# EAGLE schematic Matrix_Game_Board (EAGLE 6.5.0)
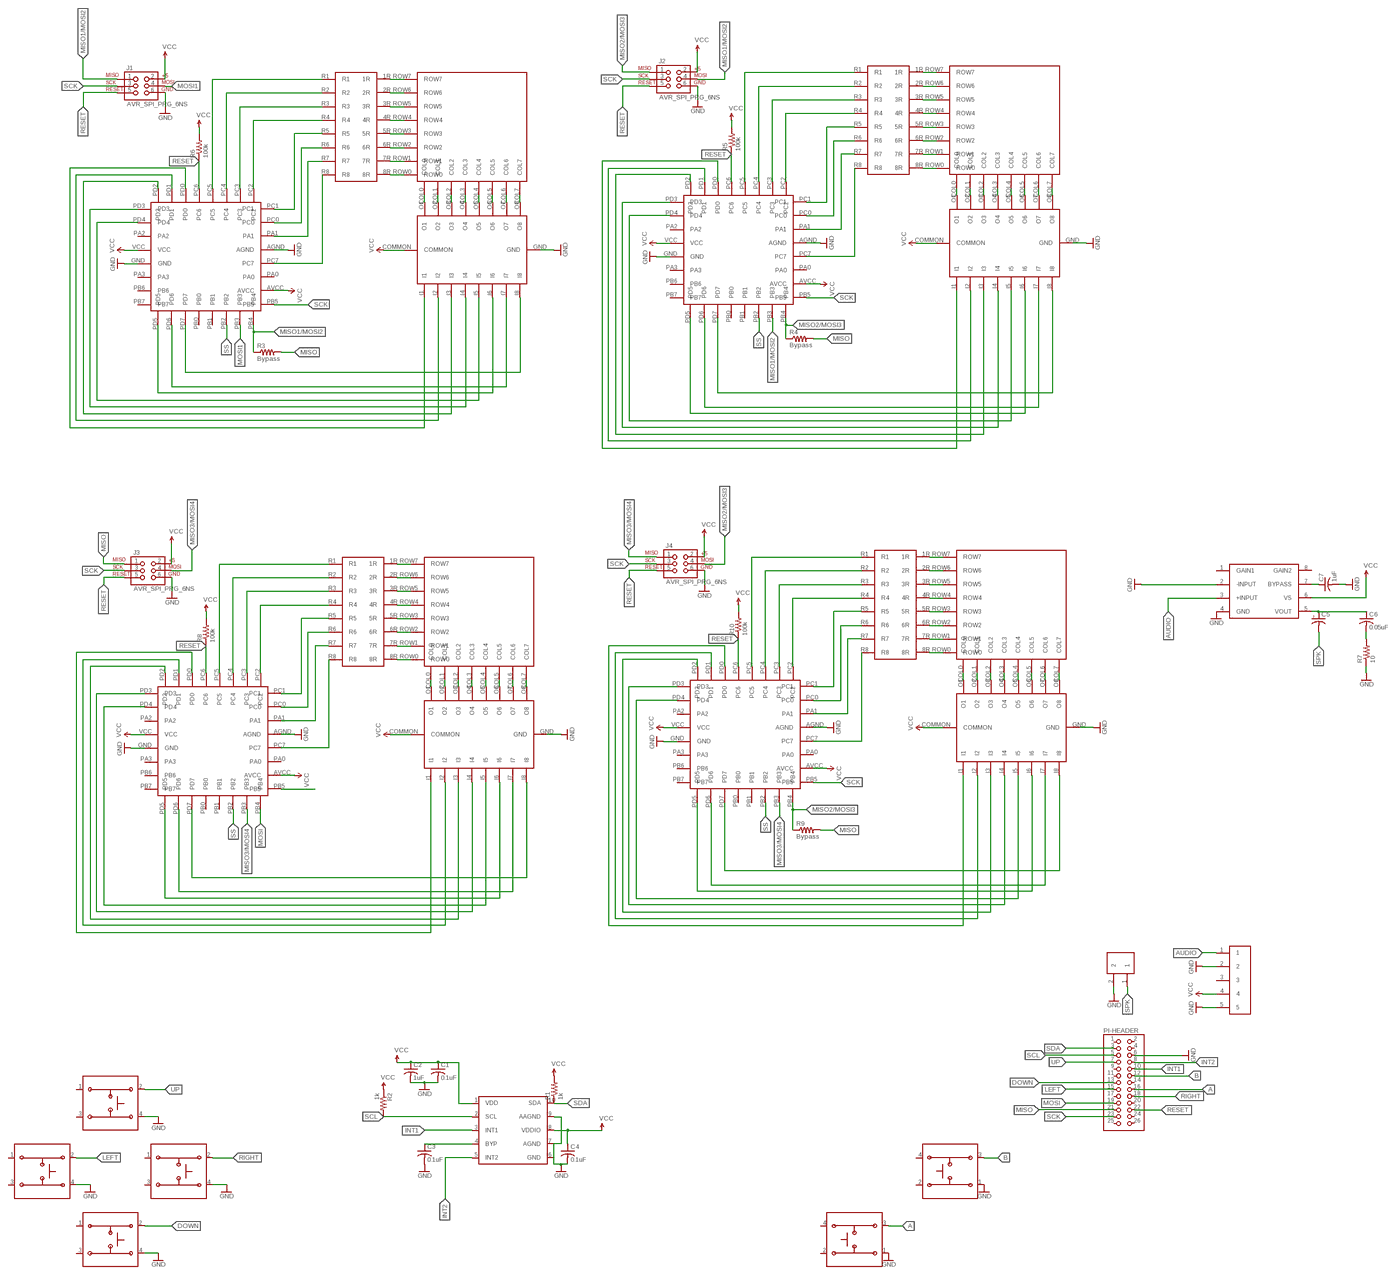
[diagram p0: schematic, sheet 1, overview]
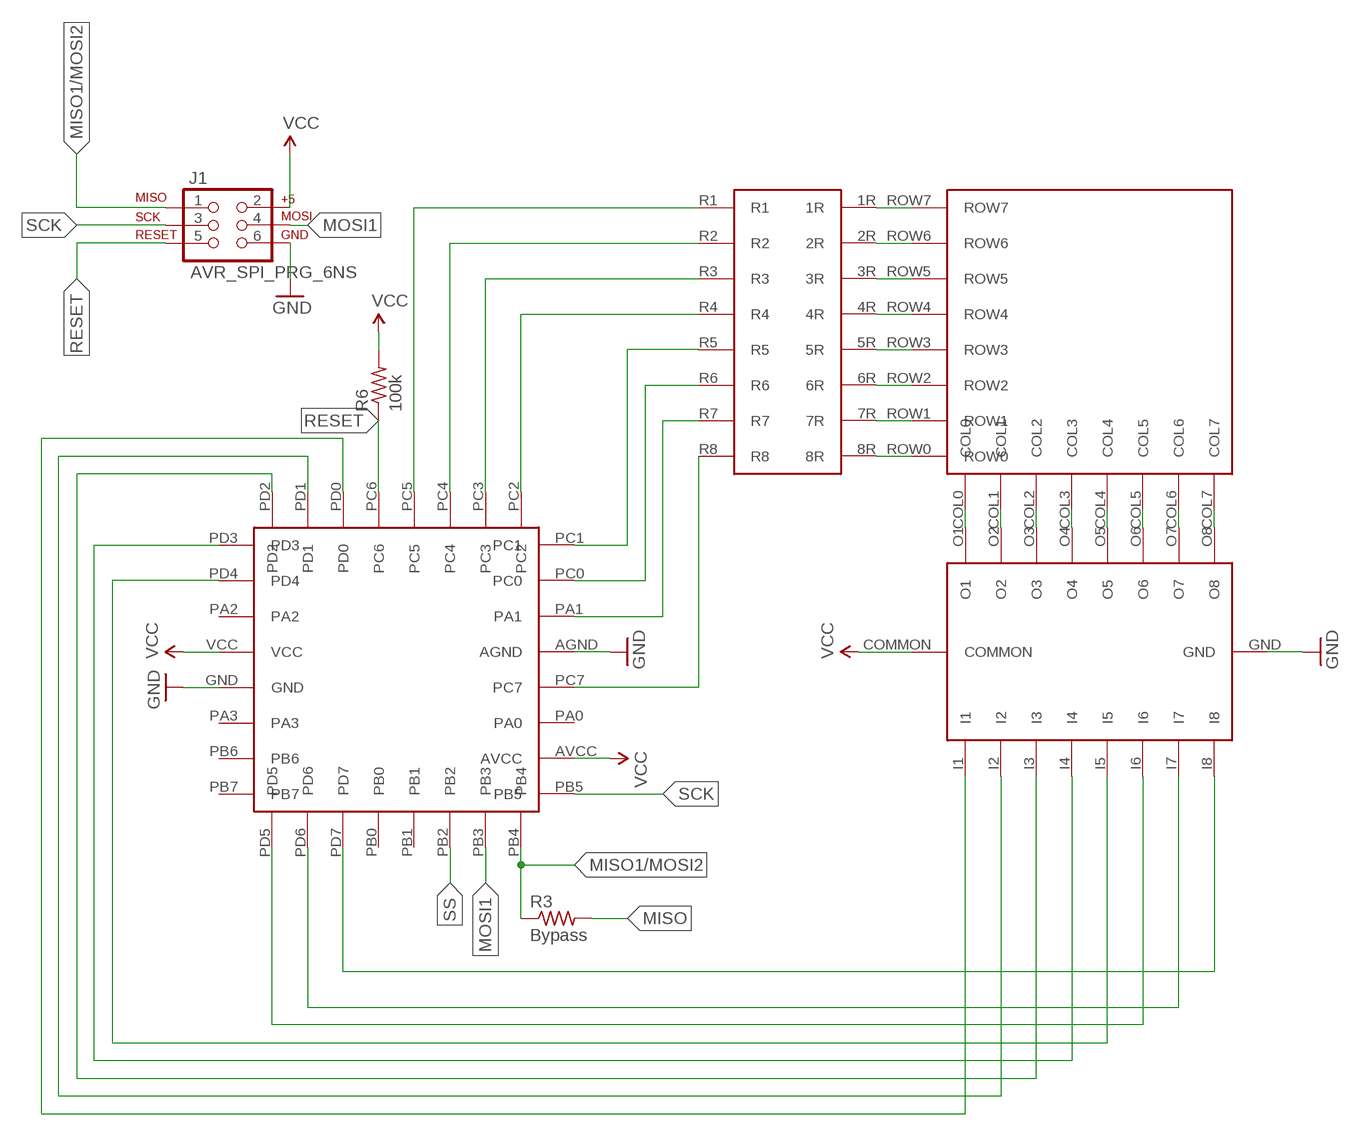
[diagram p1: schematic, sheet 1, part 1 of 4]
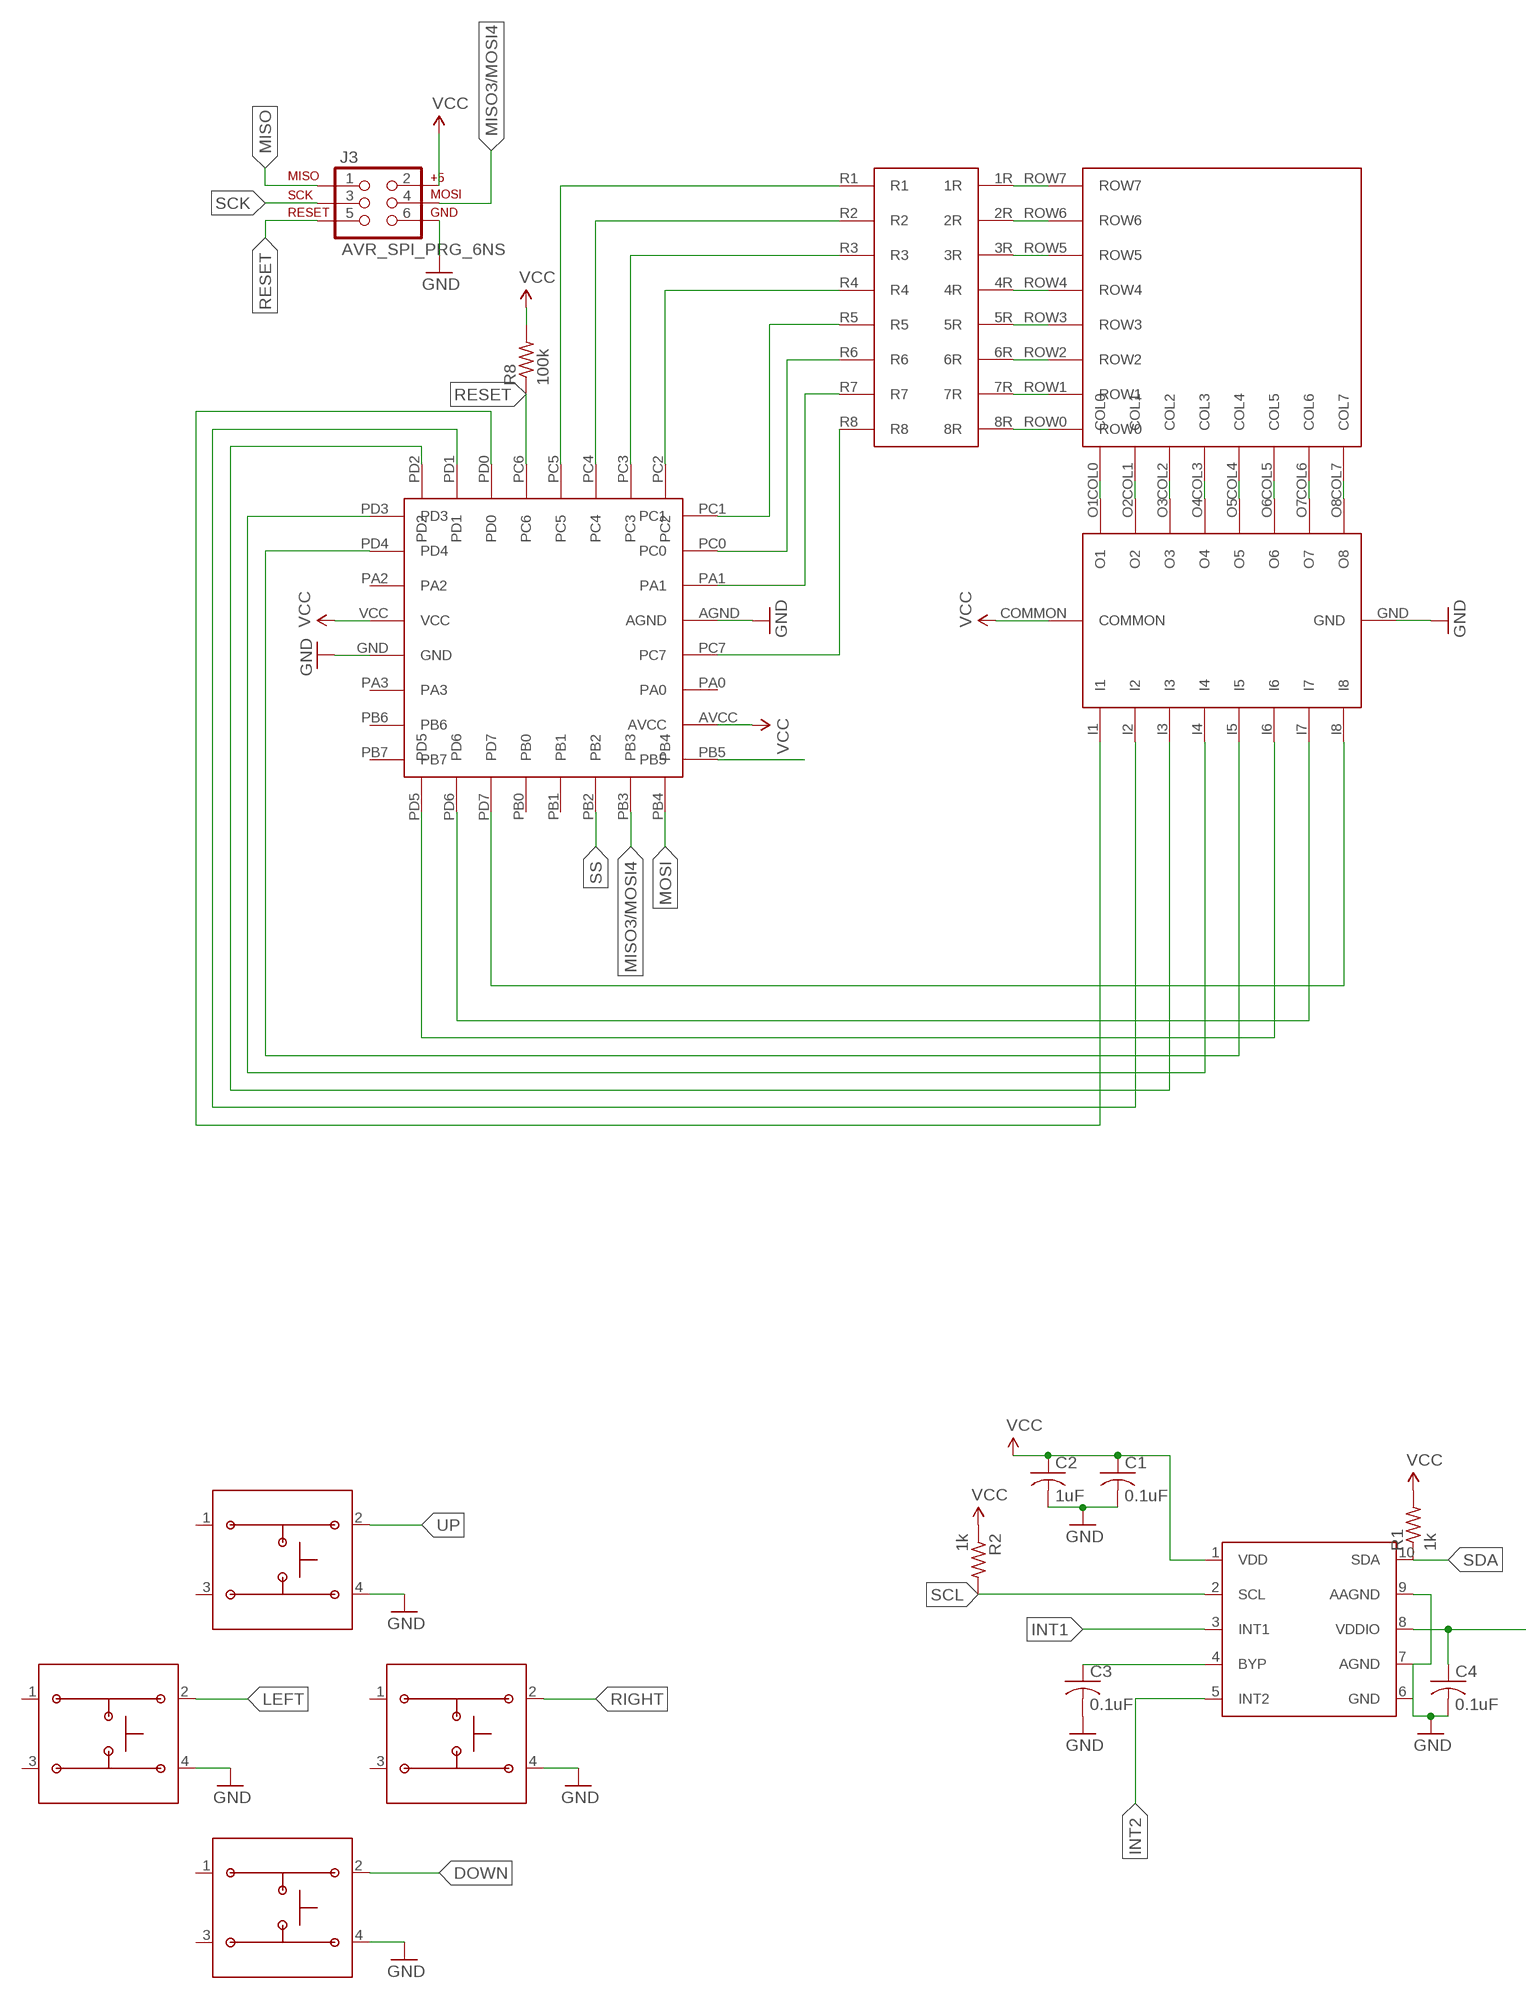
[diagram p2: schematic, sheet 1, part 2 of 4]
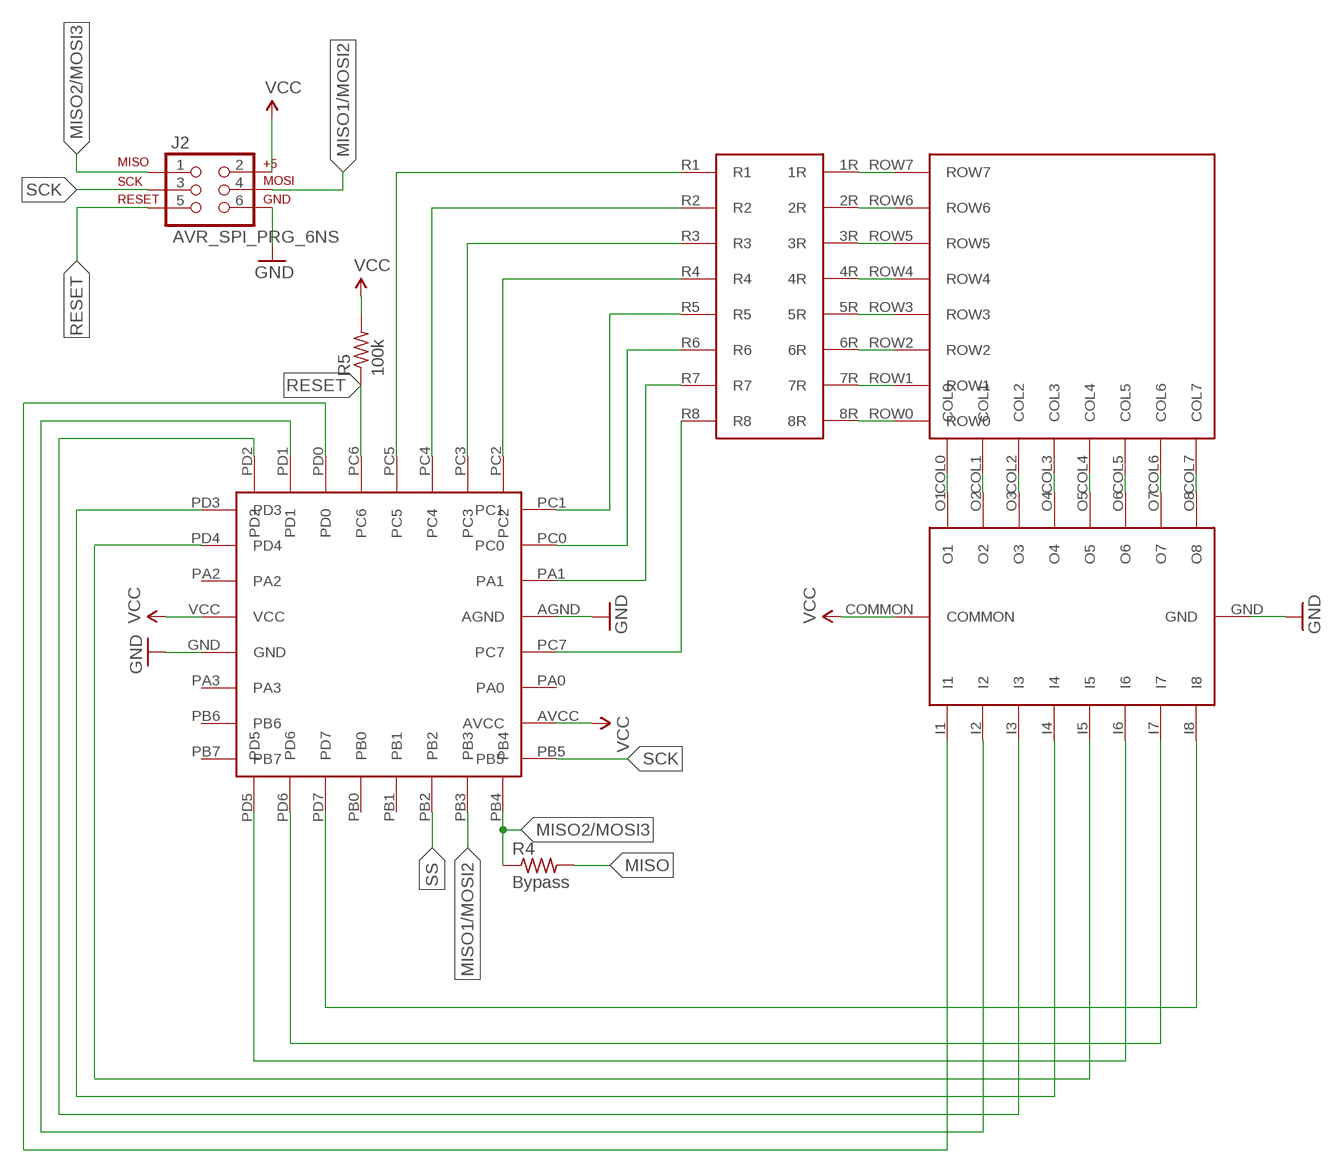
[diagram p3: schematic, sheet 1, part 3 of 4]
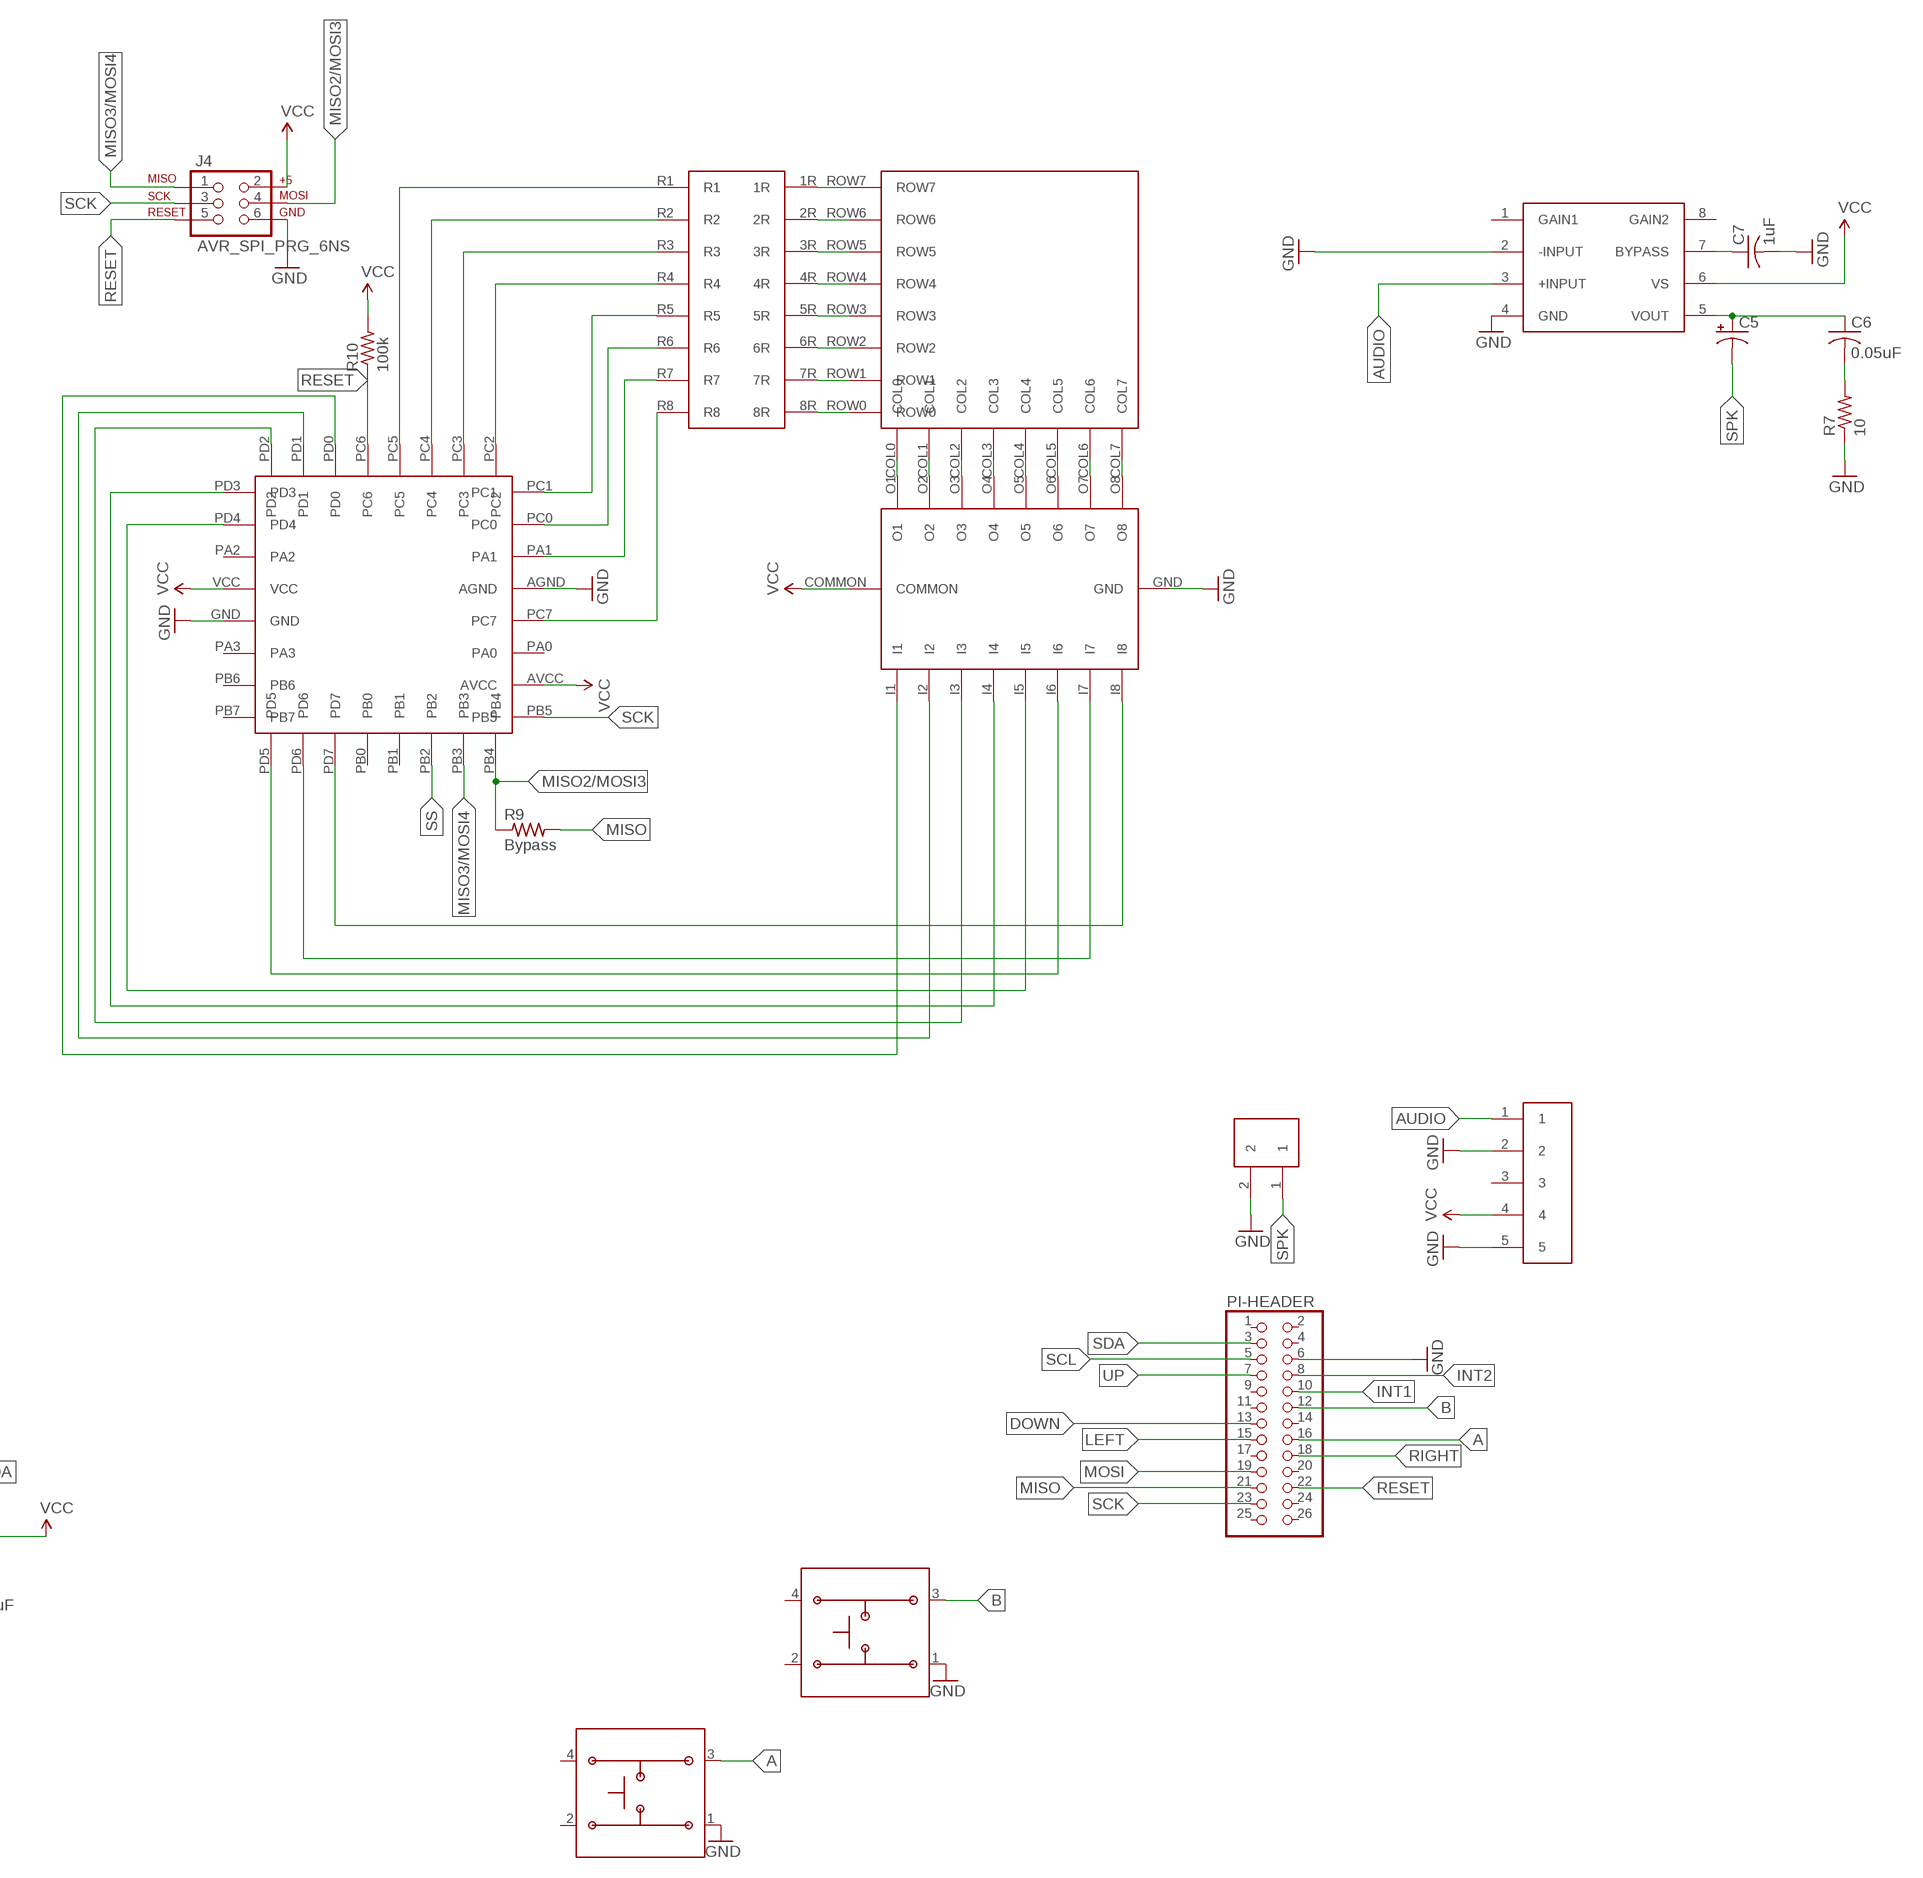
[diagram p4: schematic, sheet 1, part 4 of 4]

## Parts
C1  0.1uF  C-USC0603  [C0603]
C2  1uF  C-USC0603  [C0603]
C3  0.1uF  C-USC0603  [C0603]
C4  0.1uF  C-USC0603  [C0603]
C5  CPOL-US153CLV-0605  [153CLV-0605]
C6  0.05uF  C-USC0603  [C0603]
C7  1uF  C-USC0603  [C0603]
J1  AVR_SPI_PRG_6NS  [2X3-NS]
J2  AVR_SPI_PRG_6NS  [2X3-NS]
J3  AVR_SPI_PRG_6NS  [2X3-NS]
J4  AVR_SPI_PRG_6NS  [2X3-NS]
PI-HEADER  PINHD-2X13  [2X13]
R1  1k  R-US_R0603  [R0603]
R2  1k  R-US_R0603  [R0603]
R3  Bypass  R-US_R0805  [R0805]
R4  Bypass  R-US_R0805  [R0805]
R5  100k  R-US_R0805  [R0805]
R6  100k  R-US_R0805  [R0805]
R7  10  R-US_R0603  [R0603]
R8  100k  R-US_R0805  [R0805]
R9  Bypass  R-US_R0805  [R0805]
R10  100k  R-US_R0805  [R0805]
U$1  8X8_LED_MATRIX  [8X8_LED_MATRIX]
U$2  RES_ARRAY  [RES_ARRAY]
U$3  8X8_LED_MATRIX  [8X8_LED_MATRIX]
U$4  ULN2803AFWG  [ULN2803AFWG]
U$5  ULN2803AFWG  [ULN2803AFWG]
U$6  ATTINY48  [ATTINY48]
U$7  RES_ARRAY  [RES_ARRAY]
U$8  8X8_LED_MATRIX  [8X8_LED_MATRIX]
U$9  ATTINY48  [ATTINY48]
U$10  ULN2803AFWG  [ULN2803AFWG]
U$11  ATTINY48  [ATTINY48]
U$12  RES_ARRAY  [RES_ARRAY]
U$13  8X8_LED_MATRIX  [8X8_LED_MATRIX]
U$14  ULN2803AFWG  [ULN2803AFWG]
U$15  ATTINY48  [ATTINY48]
U$16  RES_ARRAY  [RES_ARRAY]
U$17  12X12MM_BUTTON  [12X12MM_BUTTON]
U$18  12X12MM_BUTTON  [12X12MM_BUTTON]
U$19  12X12MM_BUTTON  [12X12MM_BUTTON]
U$20  12X12MM_BUTTON  [12X12MM_BUTTON]
U$21  12X12MM_BUTTON  [12X12MM_BUTTON]
U$22  12X12MM_BUTTON  [12X12MM_BUTTON]
U$23  MMA8653FCR1  [MMA8653FCR1]
U$25  LM386  [LM386]
U$29  DF3_1X2  [DF3_1X2]
U$30  DF3_1X5  [DF3_1X5]

## Nets
A: PI-HEADER.16 U$22.3
AUDIO: U$25.3(+INPUT) U$30.1
B: PI-HEADER.12 U$21.3
DOWN: PI-HEADER.13 U$20.2
GND: C1.2 C2.2 C3.2 C4.2 C7.2 J1.6 J2.6 J3.6 J4.6 PI-HEADER.6 R7.1 U$4.GND U$5.GND U$6.AGND U$6.GND U$9.AGND U$9.GND U$10.GND U$11.AGND U$11.GND U$14.GND U$15.AGND U$15.GND U$17.4 U$18.4 U$19.4 U$20.4 U$21.1 U$22.1 U$23.6(GND) U$23.7(AGND) U$23.9(AAGND) U$25.2(-INPUT) U$25.4(GND) U$29.2 U$30.2 U$30.5
INT1: PI-HEADER.10 U$23.3(INT1)
INT2: PI-HEADER.8 U$23.5(INT2)
LEFT: PI-HEADER.15 U$18.2
MISO: J3.1 PI-HEADER.21 R3.2 R4.2 R9.2
MISO1/MOSI2: J1.1 J2.4 R3.1 U$6.PB3 U$9.PB4
MISO2/MOSI3: J2.1 J4.4 R4.1 R9.1 U$6.PB4 U$15.PB4
MISO3/MOSI4: J3.4 J4.1 U$11.PB3 U$15.PB3
MOSI: PI-HEADER.19 U$11.PB4
MOSI1: J1.4 U$9.PB3
N$1: U$1.COL0 U$5.O1
N$2: U$1.COL1 U$5.O2
N$3: U$1.COL2 U$5.O3
N$4: U$1.COL3 U$5.O4
N$5: U$1.COL4 U$5.O5
N$6: U$1.COL5 U$5.O6
N$7: U$1.COL6 U$5.O7
N$8: U$1.COL7 U$5.O8
N$9: U$1.ROW7 U$2.1R
N$10: U$1.ROW6 U$2.2R
N$11: U$1.ROW5 U$2.3R
N$12: U$1.ROW4 U$2.4R
N$13: U$1.ROW3 U$2.5R
N$14: U$1.ROW2 U$2.6R
N$15: U$1.ROW1 U$2.7R
N$16: U$1.ROW0 U$2.8R
N$17: U$5.I1 U$9.PD0
N$18: U$5.I2 U$9.PD1
N$19: U$5.I3 U$9.PD2
N$20: U$5.I4 U$9.PD3
N$21: U$5.I5 U$9.PD4
N$22: U$5.I6 U$9.PD5
N$23: U$5.I7 U$9.PD6
N$24: U$5.I8 U$9.PD7
N$25: U$2.R7 U$9.PA1
N$26: U$2.R8 U$9.PC7
N$27: U$2.R6 U$9.PC0
N$28: U$2.R5 U$9.PC1
N$29: U$2.R4 U$9.PC2
N$30: U$2.R3 U$9.PC3
N$31: U$2.R2 U$9.PC4
N$32: U$2.R1 U$9.PC5
N$33: C7.1 U$25.7(BYPASS)
N$34: C3.1 U$23.4(BYP)
N$35: C5.+ C6.1 U$25.5(VOUT)
N$36: U$3.COL0 U$4.O1
N$37: C6.2 R7.2
N$38: U$3.COL1 U$4.O2
N$39: U$3.COL2 U$4.O3
N$40: U$3.COL3 U$4.O4
N$41: U$3.COL4 U$4.O5
N$42: U$3.COL5 U$4.O6
N$43: U$3.COL6 U$4.O7
N$44: U$3.COL7 U$4.O8
N$45: U$3.ROW7 U$7.1R
N$46: U$3.ROW6 U$7.2R
N$47: U$3.ROW5 U$7.3R
N$48: U$3.ROW4 U$7.4R
N$49: U$3.ROW3 U$7.5R
N$50: U$3.ROW2 U$7.6R
N$51: U$3.ROW1 U$7.7R
N$52: U$3.ROW0 U$7.8R
N$53: U$4.I1 U$6.PD0
N$54: U$4.I2 U$6.PD1
N$55: U$4.I3 U$6.PD2
N$56: U$4.I4 U$6.PD3
N$57: U$4.I5 U$6.PD4
N$58: U$4.I6 U$6.PD5
N$59: U$4.I7 U$6.PD6
N$60: U$4.I8 U$6.PD7
N$61: U$6.PA1 U$7.R7
N$62: U$6.PC7 U$7.R8
N$63: U$6.PC0 U$7.R6
N$64: U$6.PC1 U$7.R5
N$65: U$6.PC2 U$7.R4
N$66: U$6.PC3 U$7.R3
N$67: U$6.PC4 U$7.R2
N$68: U$6.PC5 U$7.R1
N$69: U$15.PA1 U$16.R7
N$70: U$8.COL0 U$10.O1
N$71: U$8.COL1 U$10.O2
N$72: U$8.COL2 U$10.O3
N$73: U$8.COL3 U$10.O4
N$74: U$8.COL4 U$10.O5
N$75: U$8.COL5 U$10.O6
N$76: U$8.COL6 U$10.O7
N$77: U$8.COL7 U$10.O8
N$78: U$8.ROW7 U$12.1R
N$79: U$8.ROW6 U$12.2R
N$80: U$8.ROW5 U$12.3R
N$81: U$8.ROW4 U$12.4R
N$82: U$8.ROW3 U$12.5R
N$83: U$8.ROW2 U$12.6R
N$84: U$8.ROW1 U$12.7R
N$85: U$8.ROW0 U$12.8R
N$86: U$10.I1 U$11.PD0
N$87: U$10.I2 U$11.PD1
N$88: U$10.I3 U$11.PD2
N$89: U$10.I4 U$11.PD3
N$90: U$10.I5 U$11.PD4
N$91: U$10.I6 U$11.PD5
N$92: U$10.I7 U$11.PD6
N$93: U$10.I8 U$11.PD7
N$94: U$11.PA1 U$12.R7
N$95: U$11.PC7 U$12.R8
N$96: U$11.PC0 U$12.R6
N$97: U$11.PC1 U$12.R5
N$98: U$11.PC2 U$12.R4
N$99: U$11.PC3 U$12.R3
N$100: U$11.PC4 U$12.R2
N$101: U$11.PC5 U$12.R1
N$102: U$15.PC7 U$16.R8
N$103: U$13.COL0 U$14.O1
N$104: U$13.COL1 U$14.O2
N$105: U$13.COL2 U$14.O3
N$106: U$13.COL3 U$14.O4
N$107: U$13.COL4 U$14.O5
N$108: U$13.COL5 U$14.O6
N$109: U$13.COL6 U$14.O7
N$110: U$13.COL7 U$14.O8
N$111: U$13.ROW7 U$16.1R
N$112: U$13.ROW6 U$16.2R
N$113: U$13.ROW5 U$16.3R
N$114: U$13.ROW4 U$16.4R
N$115: U$13.ROW3 U$16.5R
N$116: U$13.ROW2 U$16.6R
N$117: U$13.ROW1 U$16.7R
N$118: U$13.ROW0 U$16.8R
N$119: U$14.I1 U$15.PD0
N$120: U$14.I2 U$15.PD1
N$121: U$14.I3 U$15.PD2
N$122: U$14.I4 U$15.PD3
N$123: U$14.I5 U$15.PD4
N$124: U$14.I6 U$15.PD5
N$125: U$14.I7 U$15.PD6
N$126: U$14.I8 U$15.PD7
N$129: U$15.PC0 U$16.R6
N$130: U$15.PC1 U$16.R5
N$131: U$15.PC2 U$16.R4
N$132: U$15.PC3 U$16.R3
N$133: U$15.PC4 U$16.R2
N$134: U$15.PC5 U$16.R1
RESET: J1.5 J2.5 J3.5 J4.5 PI-HEADER.22 R5.1 R6.1 R8.1 R10.1 U$6.PC6 U$9.PC6 U$11.PC6 U$15.PC6
RIGHT: PI-HEADER.18 U$19.2
SCK: J1.3 J2.3 J3.3 J4.3 PI-HEADER.23 U$6.PB5 U$9.PB5 U$11.PB5 U$15.PB5
SCL: PI-HEADER.5 R2.2 U$23.2(SCL)
SDA: PI-HEADER.3 R1.1 U$23.10(SDA)
SPK: C5.- U$29.1
SS: U$6.PB2 U$9.PB2 U$11.PB2 U$15.PB2
UP: PI-HEADER.7 U$17.2
VCC: C1.1 C2.1 C4.1 J1.2 J2.2 J3.2 J4.2 R1.2 R2.1 R5.2 R6.2 R8.2 R10.2 U$4.COMMON U$5.COMMON U$6.AVCC U$6.VCC U$9.AVCC U$9.VCC U$10.COMMON U$11.AVCC U$11.VCC U$14.COMMON U$15.AVCC U$15.VCC U$23.1(VDD) U$23.8(VDDIO) U$25.6(VS) U$30.4
Unconnected: PI-HEADER.1 PI-HEADER.2 PI-HEADER.4 PI-HEADER.9 PI-HEADER.11 PI-HEADER.14 PI-HEADER.17 PI-HEADER.20 PI-HEADER.24 PI-HEADER.25 PI-HEADER.26 U$6.PA0 U$6.PA2 U$6.PA3 U$6.PB0 U$6.PB1 U$6.PB6 U$6.PB7 U$9.PA0 U$9.PA2 U$9.PA3 U$9.PB0 U$9.PB1 U$9.PB6 U$9.PB7 U$11.PA0 U$11.PA2 U$11.PA3 U$11.PB0 U$11.PB1 U$11.PB6 U$11.PB7 U$15.PA0 U$15.PA2 U$15.PA3 U$15.PB0 U$15.PB1 U$15.PB6 U$15.PB7 U$17.1 U$17.3 U$18.1 U$18.3 U$19.1 U$19.3 U$20.1 U$20.3 U$21.2 U$21.4 U$22.2 U$22.4 U$25.1(GAIN1) U$25.8(GAIN2) U$30.3

## Library data of the parts
C1-C4 C6 C7 = resistor:C-US: CAPACITOR, American symbol
C5 = resistor:CPOL-US: POLARIZED CAPACITOR, American symbol
J1-J4 = SparkFun-Connectors:AVR_SPI_PRG_6: AVR ISP 6 Pin This is the reduced ISP connector for AVR programming. Common on Arduino. This footprint will take up less PCB space and can be used with a 10-pin to 6-pin adapter such as SKU: BOB-08508 **Special note about "TEST_POINT" package. The stop mask is on the top side, so if you want your programming test points to be on the bottom of your board, make sure to place this package on the bottom side of the board. This also ensure that the orientation to program from the bottom side will be correct.
PI-HEADER = pinhead:PINHD-2X13: PIN HEADER
R1-R10 = resistor:R-US_: RESISTOR, American symbol
U$1 U$3 U$8 U$13 = ScottSilver:8X8_LED_MATRIX
U$2 U$7 U$12 U$16 = ScottSilver:RES_ARRAY
U$4 U$5 U$10 U$14 = ScottSilver:ULN2803AFWG
U$6 U$9 U$11 U$15 = ScottSilver:ATTINY48
U$17-U$22 = ScottSilver:12X12MM_BUTTON
U$23 = ScottSilver:MMA8653FCR1
U$25 = ScottSilver:LM386
U$29 = ScottSilver:DF3_1X2
U$30 = ScottSilver:DF3_1X5